# Altium schematic sheet [11] - MOSFET.SchDoc
size A4
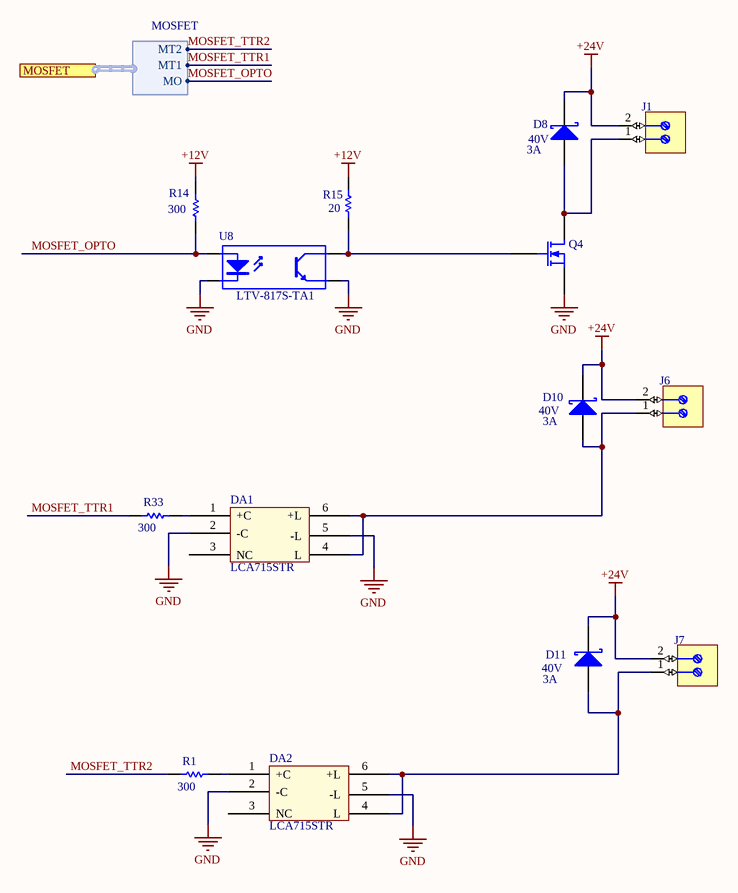
[diagram p0: [11] - MOSFET.SchDoc]

## Parts
D8  Output Current: 3A  Voltage: 40V  [D-Schottky]  (hidden comment: SK32)
D10  Output Current: 3A  Voltage: 40V  [D-Schottky]  (hidden comment: SK32)
D11  Output Current: 3A  Voltage: 40V  [D-Schottky]  (hidden comment: SK32)
DA1  LCA715STR  [6-SMD]
DA2  LCA715STR  [6-SMD]
J1  (no value)  [Connector -PHOENIX_1715721]
J6  (no value)  [Connector -PHOENIX_1715721]
J7  (no value)  [Connector -PHOENIX_1715721]
Q4  MOSFET-N  [D-PAK (TO-252)]  (value not drawn)
R1  value 300  [0603_R]  (hidden comment: Res1)
R14  Resistance: 300  [0603_R]  (hidden comment: Res1)
R15  Resistance: 20  [0603_R]  (hidden comment: Res1)
R33  value 300  [0603_R]  (hidden comment: Res1)
U8  Manufacturer Part Number: LTV-817S-TA1  [LTV-817S_LTO-L]  (hidden comment: Optoisolator1)

## Ports
MOSFET (harness MOSFET)

## Harnesses
MOSFET: MO, MT1, MT2

## Nets
+12V: R14.2 R15.2
+24V: D8.2(K) D10.2(K) D11.2(K) J1.2 J6.2 J7.2
GND: DA1.2(-C) DA1.5(-L) DA2.2(-C) DA2.5(-L) Q4.3(S) U8.2(K) U8.3(E)
MOSFET_OPTO: R14.1 U8.1(A) ; port MOSFET.MO
MOSFET_TTR1: R33.2 ; port MOSFET.MT1
MOSFET_TTR2: R1.2 ; port MOSFET.MT2
NetD8_1: D8.1(A) J1.1 Q4.2(D)
NetD10_1: D10.1(A) DA1.4(L) DA1.6(+L) J6.1
NetD11_1: D11.1(A) DA2.4(L) DA2.6(+L) J7.1
NetDA1_1: DA1.1(+C) R33.1
NetDA2_1: DA2.1(+C) R1.1
NetQ4_1: Q4.1(G) R15.1 U8.4(C)

Not connected (* = marked no-connect by the designer): DA1 3(NC); DA2 3(NC)

## Notes on the sheet
- Title
- Size:
- Date:
- A4
- Number:
- Time:
- Revision:
- Sheet
- of
- File:

## Library data of the parts
D8 D10 D11 = SK32: Schottky Rectifier; Manufacturer: Diodes; Manufacturer Part Number: B340A-13-F; Peak Reverse Current: 500uA; Forward Voltage: 500mV; Max Forward Surge Current (Ifsm): 80A; Element Configuration: Single; Polarity: Standard; Capacitance: 250pF; ComponentLink1Description: Manufacturer Link; ComponentLink1URL: http://www.irf.com/; ComponentLink2Description: Datasheet; ComponentLink2URL: http://www.irf.com/product-info/datasheets/data/18tq.pdf; Supplier 1: Digi-Key; Supplier Part Number 1: B340A-FDIDKR-ND; Stock 1: 761735; Pricing 1: 1=0.46, 10=0.373, 100=0.2538, 500=0.19034, 1000=0.14276 (USD); Mount: Surface Mount; Case/Package: SMA; Number of Pins: 2; Weight: 0.002258oz; Contact Plating: Tin,Matte; Min Operating Temperature: -55°C; Max Operating Temperature: 125°C; Forward Current: 3A; Packaging: Tape and Reel; Package Quantity: 5000; Average Rectified Current: 3A; Max Repetitive Reverse Voltage (Vrrm): 40V; Peak Non-Repetitive Surge Current: 80A; Termination: SMD/SMT; Voltage Rating (DC): 40V; Current Rating: 3A; Current: 3A; Max Reverse Voltage (DC): 40V; Length: 4.6mm; Height: 2.3mm; Width: 2.92mm; Radiation Hardening: No; REACH SVHC: No SVHC; Lead Free: Lead Free; ComponentLink3URL: https://datasheet.ciiva.com/4245/861ds30891-4245763.pdf; ComponentLink3Description: https://datasheet.ciiva.com/4245/861ds30891-4245763.pdf; ComponentLink4URL: https://datasheet.ciiva.com/26949/getdatasheetpartid-143394-26949352.pdf; ComponentLink4Description: https://datasheet.ciiva.com/26949/getdatasheetpartid-143394-26949352.pdf; ComponentLink5URL: https://datasheet.ciiva.com/1177/ds30891-1177476.pdf; ComponentLink5Description: https://datasheet.ciiva.com/1177/ds30891-1177476.pdf; ComponentLink6URL: https://datasheet.ciiva.com/1240/ds30891-1240228.pdf; ComponentLink6Description: https://datasheet.ciiva.com/1240/ds30891-1240228.pdf; ComponentLink7URL: https://datasheet.ciiva.com/913/ds30891-913637.pdf; ComponentLink7Description: https://datasheet.ciiva.com/913/ds30891-913637.pdf; ComponentLink8URL: https://datasheet.ciiva.com/913/ds30891-913638.pdf; ComponentLink8Description: https://datasheet.ciiva.com/913/ds30891-913638.pdf; ComponentLink9URL: https://datasheet.ciiva.com/913/ds30891-913639.pdf; ComponentLink9Description: https://datasheet.ciiva.com/913/ds30891-913639.pdf; ComponentLink10URL: https://datasheet.ciiva.com/46393/1911813-46393773.pdf; ComponentLink10Description: https://datasheet.ciiva.com/46393/1911813-46393773.pdf
DA1 DA2 = LCA715STR: LCA715S-TTP
J1 J6 J7 = Connection 2 PIN: Connection -POENIX; Part Number: PHOENIX_1715721; Part Description: 17.5A, 400V, Terminal Block, Pitch 5.08mm, 2 Positions, Screw Connection; Manufacturer: PHOENIX CONTACT; Manufacturer Part Number: 1715721 (MKDS 1,5/2-5,08); PressFit: No; Component Kind: Standard; Component Type: Standard; Footprint: PHOENIX_1715721; Pin Count: 2; Mounted: Yes; Socket: No; SMD: No; Sense: No; Status: None; ComponentHeight: 13.8mm; HelpURL: \\cern.ch\dfs\Applications\Altium\Datasheets\PHOENIX_1715721.pdf; Author: CERN DEM JLC; CreateDate: 06.01.2010; LatestRevisionDate: 25.02.2013
Q4 = MOSFET-N: N-Channel MOSFET; Published: 8-Jun-2000; LatestRevisionDate: 17-Jul-2002; LatestRevisionNote: Re-released for DXP Platform.; PackageVersion: 1995/1996; PackageReference: E3; Publisher: Altium Limited; PackageDescription: TO, Flat Index; 3 In-Line, Axial Leads; Body Dia. 4.6mm; Lead Dia. 0.5 mm (max)
R1 R33 = 1: Chip Resistor; Manufacturer: Stackpole Electronics Inc; Manufacturer Part Number: RMCF0603JT3K60; ID: 1; Resistance (Ohms): 3.6k; Tolerance: ±5%; Power (Watts): 0.1W, 1/10W; Temperature Coefficient: ±200ppm/°C; Published: 8-Jun-2000; LatestRevisionDate: 17-Jul-2002; LatestRevisionNote: Re-released for DXP Platform.; PackageReference: AXIAL-0.3; Publisher: Altium Limited; PackageDescription: Axial Device, Thru-Hole; 2 Leads; 0.3 in Pin Spacing; Supplier 1: Digi-Key; Supplier Part Number 1: RMCF0603JT3K60CT-ND; RoHS: RoHS Compliant; Category: Resistors; Stock 1: 6270; Pricing 1: 1=0.1, 10=0.017, 50=0.0092, 100=0.007, 250=0.0052, 500=0.00384, 1000=0.00256, 2500=0.00216 (USD); Packaging: Cut Tape (CT); Composition: Thick Film; Features: Automotive AEC-Q200; Operating Temperature: -55°C ~ 155°C; Package / Case: 0603 (1608 Metric); Supplier Device Package: 0603; Size / Dimension: 0.061" L x 0.031" W (1.55mm x 0.80mm); Height: 0.022" (0.55mm); Number of Terminations: 2; ComponentLink1URL: http://www.seielect.com/Catalog/SEI-RMCF_RMCP.pdf; ComponentLink1Description: http://www.seielect.com/Catalog/SEI-RMCF_RMCP.pdf
R14 R15 = 1: Chip Resistor; Manufacturer: Panasonic; Manufacturer Part Number: ERJ-3GEYJ222V; Power Rating: 100mW; Tolerance: 5%; Voltage Rating: 75V; Temperature Coefficient: 200ppm/°C; Voltage Rating (DC): 50V; ComponentLink1URL: https://datasheet.ciiva.com/11821/0900766b80f806dd-11821453.pdf; ComponentLink1Description: https://datasheet.ciiva.com/11821/0900766b80f806dd-11821453.pdf; ComponentLink2URL: https://datasheet.ciiva.com/34303/1988639-34303614.pdf; ComponentLink2Description: https://datasheet.ciiva.com/34303/1988639-34303614.pdf; ComponentLink3URL: https://datasheet.ciiva.com/16760/70255313-16760341.pdf; ComponentLink3Description: https://datasheet.ciiva.com/16760/70255313-16760341.pdf; ComponentLink4URL: https://datasheet.ciiva.com/9117/aoa0000ce1-9117127.pdf; ComponentLink4Description: https://datasheet.ciiva.com/9117/aoa0000ce1-9117127.pdf; ComponentLink5URL: https://datasheet.ciiva.com/46380/1500035-46380411.pdf; ComponentLink5Description: https://datasheet.ciiva.com/46380/1500035-46380411.pdf; ComponentLink6URL: https://datasheet.ciiva.com/16765/70255313-16765244.pdf; ComponentLink6Description: https://datasheet.ciiva.com/16765/70255313-16765244.pdf; ComponentLink7URL: https://datasheet.ciiva.com/16199/aoa0000ce1-16199902.pdf; ComponentLink7Description: https://datasheet.ciiva.com/16199/aoa0000ce1-16199902.pdf; ComponentLink8URL: https://datasheet.ciiva.com/16853/aoa0000ce1-16853407.pdf; ComponentLink8Description: https://datasheet.ciiva.com/16853/aoa0000ce1-16853407.pdf; ComponentLink9URL: https://datasheet.ciiva.com/22758/1500035-22758223.pdf; ComponentLink9Description: https://datasheet.ciiva.com/22758/1500035-22758223.pdf; ComponentLink10URL: https://datasheet.ciiva.com/28584/1678796-28584095.pdf; ComponentLink10Description: https://datasheet.ciiva.com/28584/1678796-28584095.pdf; Supplier 1: Digi-Key; Supplier Part Number 1: P2.2KGDKR-ND; Stock 1: 1578287; Pricing 1: 1=0.1, 10=0.054, 100=0.022, 1000=0.00988, 2500=0.00858 (USD); Mount: Surface Mount; Case/Package: 0603; Case Code (Imperial): 0603; Case Code (Metric): 1608; Contact Plating: Tin; Min Operating Temperature: -55°C; Max Operating Temperature: 155°C; Package Quantity: 1; Packaging: Tape and Reel; Composition: Thick Film; Number of Terminations: 2; Military Standard: Not; Termination: SMD/SMT; Max Power Dissipation: 100mW; Features: Automotive AEC-Q200; Working Voltage: 75V; Length: 1.6mm; Height: 0.45mm; Width: 0.8mm; Depth: 0.8mm; Radiation Hardening: No; REACH SVHC: No SVHC; Lead Free: Lead Free
U8 = Optoisolator1: 4-Pin Phototransistor Optocoupler; Manufacturer: Toshiba; Collector Emitter Voltage (VCEO): 80V; Collector Emitter Saturation Voltage: 300mV; Max Collector Current: 50mA; Max Power Dissipation: 200mW; Number of Channels: 1; Forward Voltage: 1.4V; Forward Current: 20mA; Current Transfer Ratio: 400%; Isolation Voltage: 3.75kV; Direction: Unidirectional; Peak Pulse Power: 400W; Max Reverse Leakage Current: 20uA; Clamping Voltage: 14.5V; Reverse Standoff Voltage: 6.5V; Min Breakdown Voltage: 7.2V; Test Current: 10mA; Element Configuration: Single; Peak Pulse Current: 160A; Supplier 1: Digi-Key; Supplier Part Number 1: TLP184(TPRE)CT-ND; RoHS: Yes; Stock 1: 8604; Pricing 1: 1 = 0,73000, 10 = 0,52800, 25 = 0,43080, 100 = 0,34460, 250 = 0,29076, 500 = 0,24768, 1000 = 0,19384 (USD); Mount: Surface Mount; Case/Package: SMD/SMT; Number of Pins: 4; Min Operating Temperature: -55°C; Max Operating Temperature: 110°C; Packaging: Tape and Reel; Number of Elements: 1; Power Dissipation: 200mW; Package Quantity: 1; Max Output Voltage: 80V; Output Current per Channel: 50mA; Radiation Hardening: No; ComponentLink1URL: https://datasheet.ciiva.com/2086/tlp184-datasheet-en-20140908-2086688.pdf?src-supplier=Digi-Key; ComponentLink1Description: https://datasheet.ciiva.com/2086/tlp184-datasheet-en-20140908-2086688.pdf?src-supplier=Digi-Key